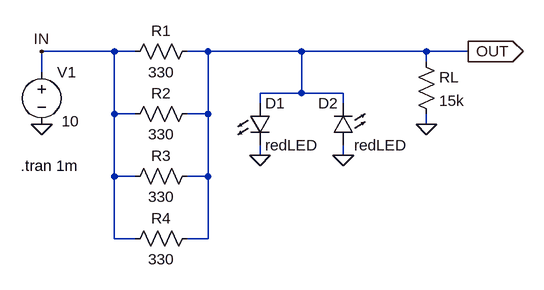
[diagram p0: schematic LED_Limiter_RL=15k_330x4.asc]
LED_Limiter_RL=15k_330x4.asc, the LTspice schematic file:
Version 4
SHEET 1 880 680
WIRE 96 80 -16 80
WIRE 128 80 96 80
WIRE 240 80 208 80
WIRE 384 80 240 80
WIRE 576 80 384 80
WIRE 640 80 576 80
WIRE 576 96 576 80
WIRE -16 112 -16 80
WIRE 384 144 384 80
WIRE 384 144 320 144
WIRE 448 144 384 144
WIRE 320 160 320 144
WIRE 448 160 448 144
WIRE 96 176 96 80
WIRE 128 176 96 176
WIRE 240 176 240 80
WIRE 240 176 208 176
WIRE 576 192 576 176
WIRE 320 240 320 224
WIRE 448 240 448 224
WIRE 96 272 96 176
WIRE 128 272 96 272
WIRE 240 272 240 176
WIRE 240 272 208 272
WIRE 96 368 96 272
WIRE 128 368 96 368
WIRE 240 368 240 272
WIRE 240 368 208 368
FLAG 640 80 OUT
IOPIN 640 80 Out
FLAG -16 192 0
FLAG 320 240 0
FLAG 448 240 0
FLAG -16 80 IN
FLAG 576 192 0
SYMBOL voltage -16 96 R0
WINDOW 3 31 91 Left 2
WINDOW 123 0 0 Left 2
WINDOW 39 0 0 Left 2
SYMATTR Value 10
SYMATTR InstName V1
SYMBOL LED 304 160 R0
SYMATTR InstName D1
SYMATTR Value redLED
SYMBOL LED 464 224 R180
WINDOW 0 24 64 Left 2
WINDOW 3 -83 0 Left 2
SYMATTR InstName D2
SYMATTR Value redLED
SYMBOL res 224 64 R90
WINDOW 0 0 56 VBottom 2
WINDOW 3 32 56 VTop 2
SYMATTR InstName R1
SYMATTR Value 330
SYMBOL res 560 80 R0
SYMATTR InstName RL
SYMATTR Value 15k
SYMBOL res 224 160 R90
WINDOW 0 0 56 VBottom 2
WINDOW 3 32 56 VTop 2
SYMATTR InstName R2
SYMATTR Value 330
SYMBOL res 224 256 R90
WINDOW 0 0 56 VBottom 2
WINDOW 3 32 56 VTop 2
SYMATTR InstName R3
SYMATTR Value 330
SYMBOL res 224 352 R90
WINDOW 0 0 56 VBottom 2
WINDOW 3 32 56 VTop 2
SYMATTR InstName R4
SYMATTR Value 330
TEXT -48 256 Left 2 !.tran 1m

The netlist it stands for:
* LED_Limiter_RL=15k_330x4.asc
V1 IN 0 10
D1 OUT 0 redLED
D2 0 OUT redLED
R1 OUT IN 330
RL OUT 0 15k
R2 OUT IN 330
R3 OUT IN 330
R4 OUT IN 330
.model D D
.lib standard.dio
.tran 1m
.backanno
.end